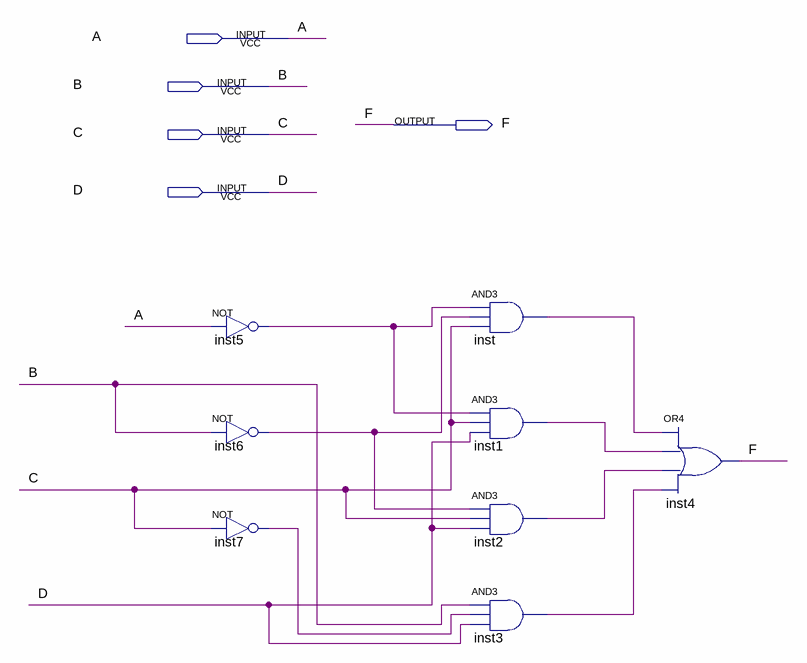
[diagram p0: schematic sheet]
// Quartus schematic newprime.bdf as structural Verilog: 8 symbols, 5 pins
module newprime (
  input  A,
  input  B,
  input  C,
  input  D,
  output F
);

  wire inst1_out, inst2_out, inst3_out, inst5_out, inst6_out, inst7_out, inst_out;

  not inst5 (inst5_out, A);
  not inst6 (inst6_out, B);
  not inst7 (inst7_out, C);
  and inst (inst_out, inst5_out, inst6_out, C);
  and inst1 (inst1_out, inst5_out, C, D);
  and inst2 (inst2_out, inst6_out, C, D);
  and inst3 (inst3_out, B, inst7_out, D);
  or inst4 (F, inst_out, inst1_out, inst2_out, inst3_out);
endmodule
